# Altium schematic sheet sensor-header.SchDoc
size B
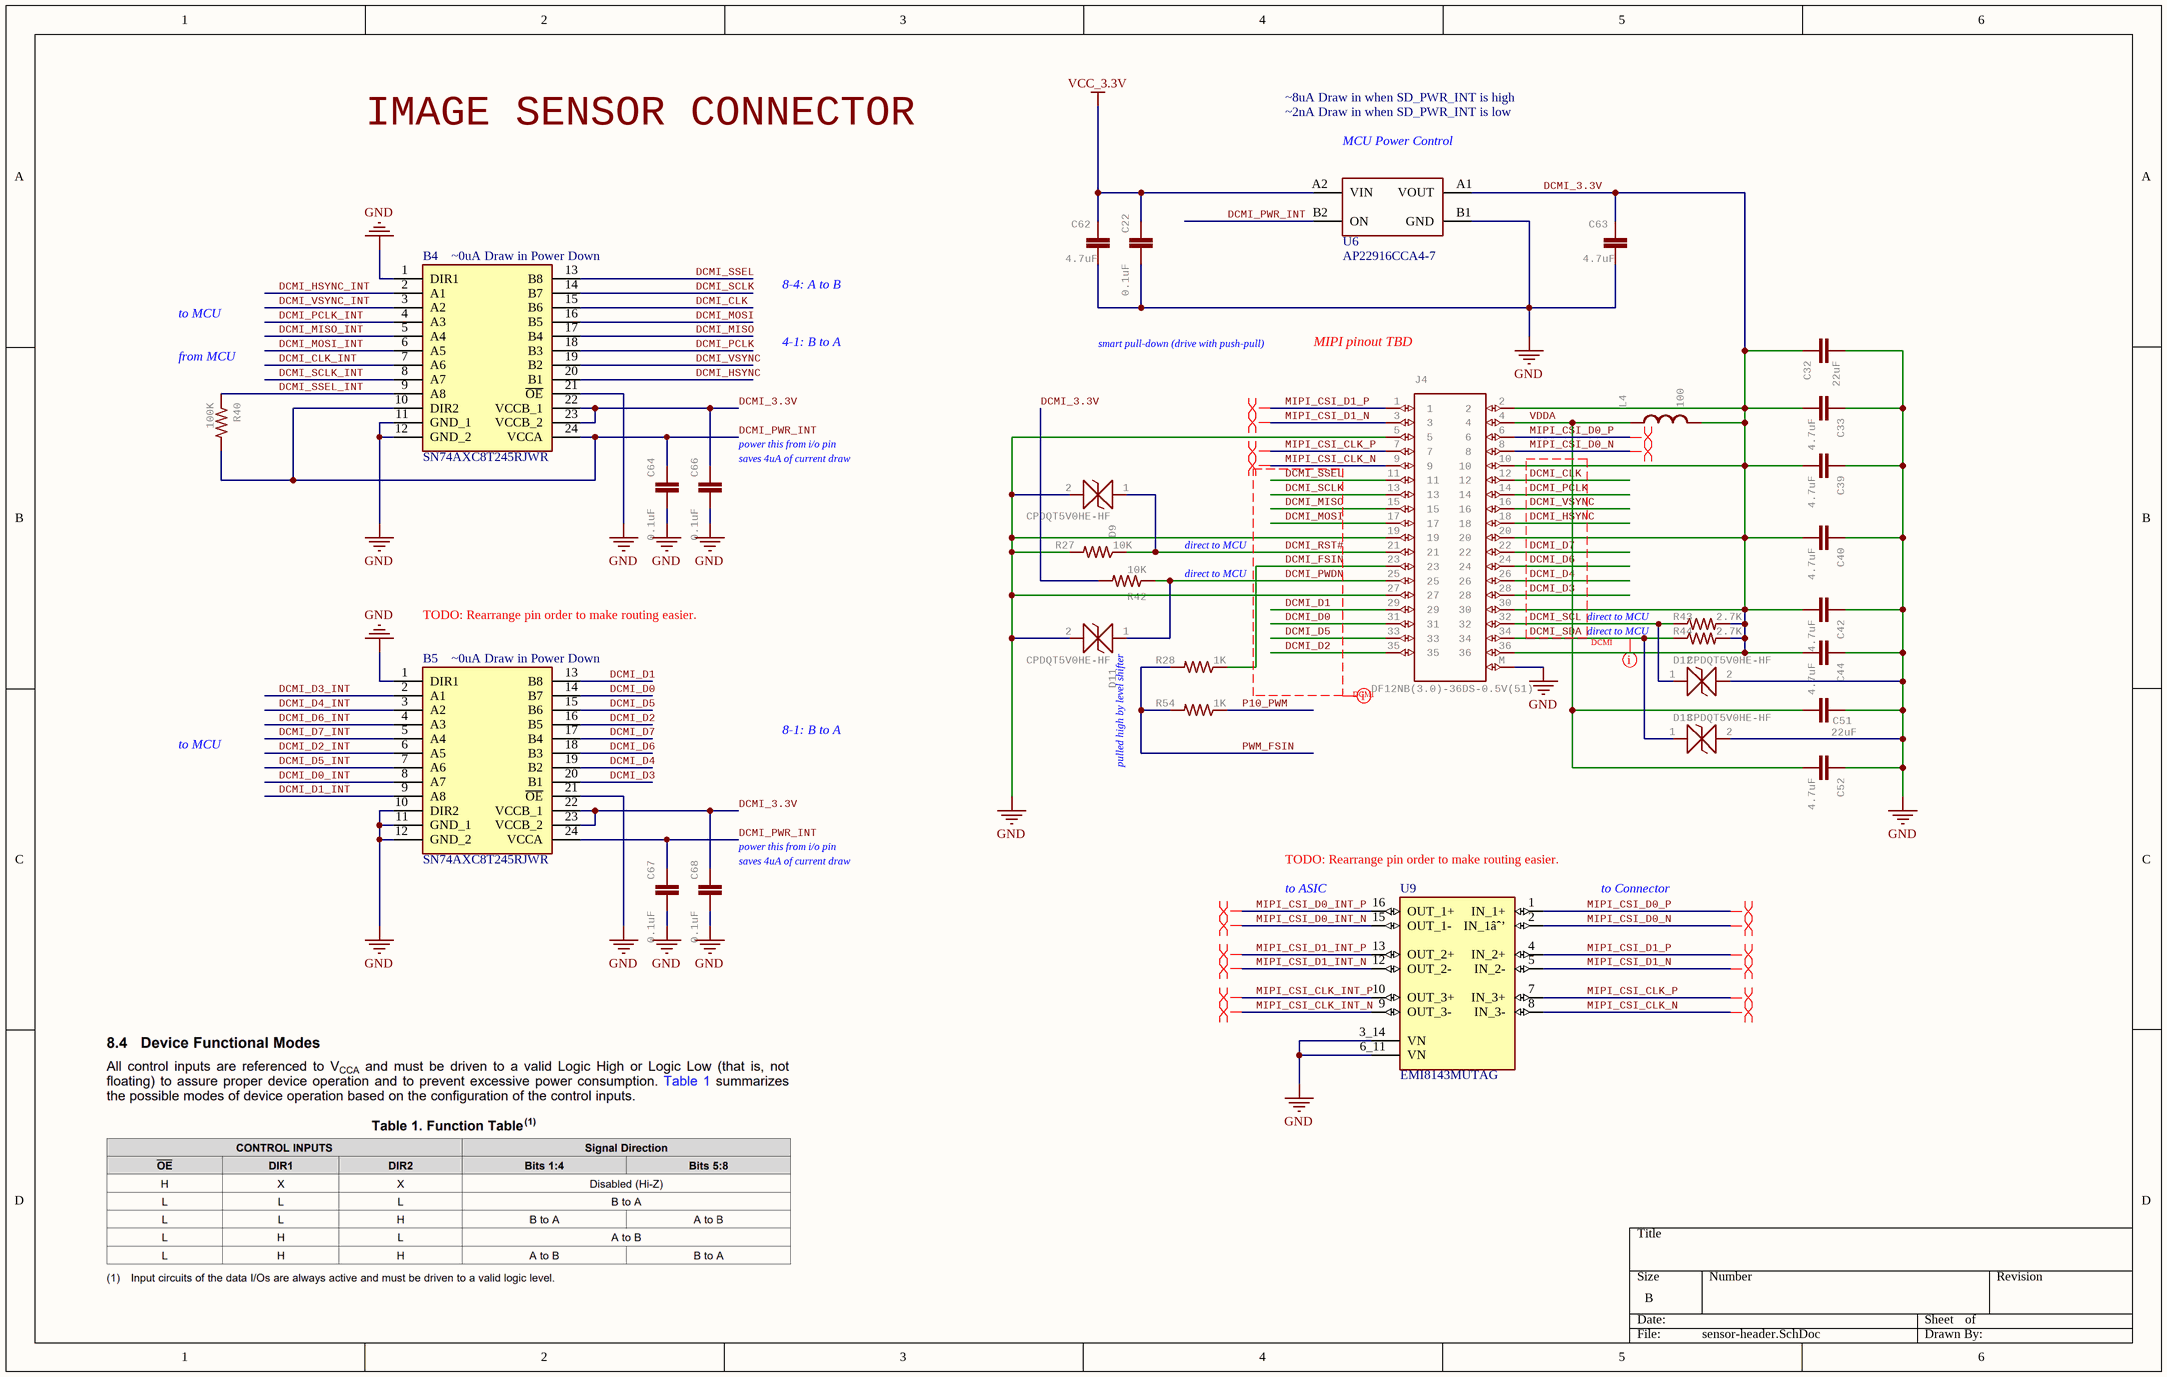
[diagram p0: sensor-header.SchDoc]

## Parts
B4  SN74AXC8T245RJWR  [SN74AXC8T245RJWR]
B5  SN74AXC8T245RJWR  [SN74AXC8T245RJWR]
C22  0.1uF  [0402-CAP]
C32  22uF  [0805]
C33  4.7uF  [0402-CAP]
C39  4.7uF  [0402-CAP]
C40  4.7uF  [0402-CAP]
C42  4.7uF  [0402-CAP]
C44  4.7uF  [0402-CAP]
C51  22uF  [0805]
C52  4.7uF  [0402-CAP]
C62  4.7uF  [0402-CAP]
C63  4.7uF  [0402-CAP]
C64  0.1uF  [0402-CAP]
C66  0.1uF  [0402-CAP]
C67  0.1uF  [0402-CAP]
C68  0.1uF  [0402-CAP]
D9  CPDQT5V0HE-HF  [CPDQT5V0HEHF]
D11  CPDQT5V0HE-HF  [CPDQT5V0HEHF]
D12  CPDQT5V0HE-HF  [CPDQT5V0HEHF]
D13  CPDQT5V0HE-HF  [CPDQT5V0HEHF]
J4  DF12NB(3.0)-36DS-0.5V(51)  [DF12-36-DS]
L4  100  [C0402]
R27  10K  [R0201]
R28  1K  [R0201]
R40  100K  [R0201]
R42  10K  [R0201]
R43  2.7K  [R0201]
R44  2.7K  [R0201]
R54  1K  [R0201]
U6  PMOS Load Switch  [AP22916CCA4-7]  (value not drawn)
U9  EMI8143MUTAG  [IC_EMI8143MUTAG]

## Nets
GND: B4.1(DIR1) B4.11(GND_1) B4.12(GND_2) B4.21(~{OE}) B5.1(DIR1) B5.10(DIR2) B5.11(GND_1) B5.12(GND_2) B5.21(~{OE}) C22.2 C32.2 C33.1 C39.1 C40.1 C42.1 C44.1 C51.2 C52.1 C62.2 C63.2 C64.2 C66.2 C67.2 C68.2 D9.2 D11.2 D12.2 D13.2 J4.5 J4.19 J4.27 J4.M R27.2 U6.B1(GND) U9.3_14(VN) U9.6_11(VN)
VCC_3.3V: C22.1 C62.1 U6.A2(VIN)
DCMI_3.3V: B4.22(VCCB_1) B4.23(VCCB_2) B5.22(VCCB_1) B5.23(VCCB_2) C32.1 C33.2 C39.2 C40.2 C42.2 C44.2 C63.1 C66.1 C68.1 J4.2 J4.10 J4.20 J4.30 J4.36 L4.2 R42.2 R43.2 R44.2 U6.A1(VOUT)
DCMI_CLK: B4.15(B6) J4.12
DCMI_CLK_INT: B4.7(A6)
DCMI_D0: B5.14(B7) J4.31
DCMI_D0_INT: B5.8(A7)
DCMI_D1: B5.13(B8) J4.29
DCMI_D1_INT: B5.9(A8)
DCMI_D2: B5.16(B5) J4.35
DCMI_D2_INT: B5.6(A5)
DCMI_D3: B5.20(B1) J4.28
DCMI_D3_INT: B5.2(A1)
DCMI_D4: B5.19(B2) J4.26
DCMI_D4_INT: B5.3(A2)
DCMI_D5: B5.15(B6) J4.33
DCMI_D5_INT: B5.7(A6)
DCMI_D6: B5.18(B3) J4.24
DCMI_D6_INT: B5.4(A3)
DCMI_D7: B5.17(B4) J4.22
DCMI_D7_INT: B5.5(A4)
DCMI_FSIN: J4.23 R28.1
DCMI_HSYNC: B4.20(B1) J4.18
DCMI_HSYNC_INT: B4.2(A1)
DCMI_MISO: B4.17(B4) J4.15
DCMI_MISO_INT: B4.5(A4)
DCMI_MOSI: B4.16(B5) J4.17
DCMI_MOSI_INT: B4.6(A5)
DCMI_PCLK: B4.18(B3) J4.14
DCMI_PCLK_INT: B4.4(A3)
DCMI_PWDN: D11.1 J4.25 R42.1
DCMI_PWR_INT: B4.10(DIR2) B4.24(VCCA) B5.24(VCCA) C64.1 C67.1 R40.2 U6.B2(ON)
DCMI_RST#: D9.1 J4.21 R27.1
DCMI_SCL: D12.1 J4.32 R43.1
DCMI_SCLK: B4.14(B7) J4.13
DCMI_SCLK_INT: B4.8(A7)
DCMI_SDA: D13.1 J4.34 R44.1
DCMI_SSEL: B4.13(B8) J4.11
DCMI_SSEL_INT: B4.9(A8) R40.1
DCMI_VSYNC: B4.19(B2) J4.16
DCMI_VSYNC_INT: B4.3(A2)
MIPI_CSI_CLK_INT_N: U9.9(OUT_3-)
MIPI_CSI_CLK_INT_P: U9.10(OUT_3+)
MIPI_CSI_CLK_N: J4.9 U9.8(IN_3-)
MIPI_CSI_CLK_P: J4.7 U9.7(IN_3+)
MIPI_CSI_D0_INT_N: U9.15(OUT_1-)
MIPI_CSI_D0_INT_P: U9.16(OUT_1+)
MIPI_CSI_D0_N: J4.8 U9.2(IN_1âˆ’)
MIPI_CSI_D0_P: J4.6 U9.1(IN_1+)
MIPI_CSI_D1_INT_N: U9.12(OUT_2-)
MIPI_CSI_D1_INT_P: U9.13(OUT_2+)
MIPI_CSI_D1_N: J4.3 U9.5(IN_2-)
MIPI_CSI_D1_P: J4.1 U9.4(IN_2+)
P10_PWM: R54.1
PWM_FSIN: R28.2 R54.2
VDDA: C51.1 C52.2 J4.4 L4.1

## Layout directives
net class DCMI: DCMI_D0, DCMI_D1, DCMI_D2, DCMI_D5, DCMI_FSIN, DCMI_MISO, DCMI_MOSI, DCMI_PWDN, DCMI_RST#, DCMI_SCLK, DCMI_SDA, DCMI_SSEL
differential pair; differential pair class MIPI: MIPI_CSI_CLK_INT_N, MIPI_CSI_CLK_INT_P, MIPI_CSI_CLK_N, MIPI_CSI_CLK_P, MIPI_CSI_D0_INT_N, MIPI_CSI_D0_INT_P, MIPI_CSI_D0_N, MIPI_CSI_D0_P, MIPI_CSI_D1_INT_N, MIPI_CSI_D1_INT_P, MIPI_CSI_D1_N, MIPI_CSI_D1_P

## Notes on the sheet
- ~8uA Draw in when SD_PWR_INT is high
- IMAGE SENSOR CONNECTOR
- ~2nA Draw in when SD_PWR_INT is low
- (near U6) MCU Power Control
- to MCU
- (near B4) ~0uA Draw in Power Down
- 8-4: A to B
- (near R40) from MCU
- 4-1: B to A
- smart pull-down (drive with push-pull)
- MIPI pinout TBD
- (near C66) power this from i/o pin
- (near C66) saves 4uA of current draw
- direct to MCU
- (near R42) direct to MCU
- TODO: Rearrange pin order to make routing easier.
- (near B5) ~0uA Draw in Power Down
- 8-1: B to A
- (near D11) pulled high by level shifter
- (near C68) power this from i/o pin
- (near C68) saves 4uA of current draw
- (near U9) TODO: Rearrange pin order to make routing easier.
- to ASIC
- to Connector

## Library data of the parts
B4 B5 = SN74AXC8T245RJWR: 8-Bit Dual-Supply Bus Transceiver; Manufacturer_Name: Texas Instruments; Geometry.Height: 0.55mm; Mouser Part Number: 595-SN74AXC8T245RJWR; Mouser Price/Stock: https://www.mouser.co.uk/ProductDetail/Texas-Instruments/SN74AXC8T245RJWR?qs=lc2O%252BfHJPVZ0xWM%2FSARpgw%3D%3D; Manufacturer_Part_Number: SN74AXC8T245RJWR; Datasheet Link: http://www.ti.com/lit/gpn/sn74axc8t245; MPN: SN74AXC8T245RJWR; Part Number: SN74AXC8T245RJWR
C22 C64 C66-C68 = C-EUC0201: CAPACITOR, European symbol; MPN: C0402C104Z4VAC; GateName_1: G$1; SymbolName_1: C-EU; POPULARITY: 0; LibraryName: rcl; DeviceSetName: C-EU; SPICEPREFIX: C; Part Number: C0402C104Z4VAC
C32 C51 = 22UF-0805-6.3V-20%: 22ÂµF ceramic capacitors    A capacitor is a passive two-terminal electrical component used to store electrical energy temporarily in an electric field.; MPN: CL21A226MQQNNNE; GateName_1: G$1; SymbolName_1: CAP; PROD_ID: CAP-08402; DeviceName: -0805-6.3V-20%; LibraryName: SparkFun-Capacitors; DeviceSetName: 22UF; Part Number: CL21A226MQQNNNE
C33 C39 C40 C42 C44 C52 C62 C63 = CAP0402-CAP: CapacitorStandard 0603 ceramic capacitor, and 0.1" leaded capacitor.; MPN: JMK105BBJ475MV-F; GateName_1: G$1; SymbolName_1: CAP; DeviceName: 0402-CAP; LibraryName: sfe; DeviceSetName: CAP; Part Number: JMK105BBJ475MV-F
D9 D11-D13 = CPDQT5V0HE-HF: ESD Suppressors / TVS Diodes DIODE ESD 5VWM 65W 0402/SOD-923F   Source:  Datasheet; MANUFACTURER_NAME: Comchip Technology; GateName_1: G$1; SymbolName_1: CPDQT5V0HE-HF; LibraryName: CPDQT5V0HE-HF; DeviceSetName: CPDQT5V0HE-HF; HEIGHT: 0.42mm; MANUFACTURER_PART_NUMBER: CPDQT5V0HE-HF; MOUSER_PART_NUMBER: MOUSER_PART_NUMBER; MOUSER_PRICE-STOCK: MOUSER_PRICE-STOCK; MPN: CPDQT5V0HE-HF; Part Number: CPDQT5V0HE-HF
J4 = DF12-36-DS: Header; GateName_1: G$1; SymbolName_1: DF12-36; LibraryName: DF12-36-DS; DeviceSetName: DF12-36-DS; MPN: DF12NB(3.0)-36DS-0.5V(51); Part Number: DF12NB(3.0)-36DS-0.5V(51)
L4 = INDUCTOR0402: InductorsBasic Inductor/Choke - 0603 and 1206. Footprints are not proven and vary greatly between part numbers.; MPN: MFBM1V1005-101-R; GateName_1: G$1; DeviceName: 0402; SymbolName_1: INDUCTOR; LibraryName: sfe; DeviceSetName: INDUCTOR; Part Number: MFBM1V1005-101-R
R27 R28 R40 R42-R44 R54 = RESISTOR0402-RES: GateName_1: G$1; SymbolName_1: RESISTOR; LibraryName: sfe; DeviceSetName: RESISTOR
U6 = AP22916CCA4-7: MF: Diodes Inc; MPN: AP22916CCA4-7
U9 = CMP-008-000000-1: 6 Line Common Mode Choke Surface Mount 100mA DCR 6Ohm (Typ); MF: ON Semiconductor; Design Item ID: EMI8143MUTAG; Source: EMI8143MUTAG.SchLib; Package: XDFN-16 ON Semiconductor; Pin Count: 14; MP: EMI8143MUTAG; Component Type: Standard; Digi-Key_Part_Number: EMI8143MUTAGOSCT-ND; Value: *; SnapEDA_Link: https://www.snapeda.com/parts/EMI8143MUTAG/ON%20Semiconductor/view-part/182093/?ref=snap; Purchase-URL: https://pricing.snapeda.com/search/part/EMI8143MUTAG/?ref=eda; MPN: EMI8143MUTAG; Part Number: EMI8143MUTAG